# EAGLE schematic harp camera controller (EAGLE 9.5.1)
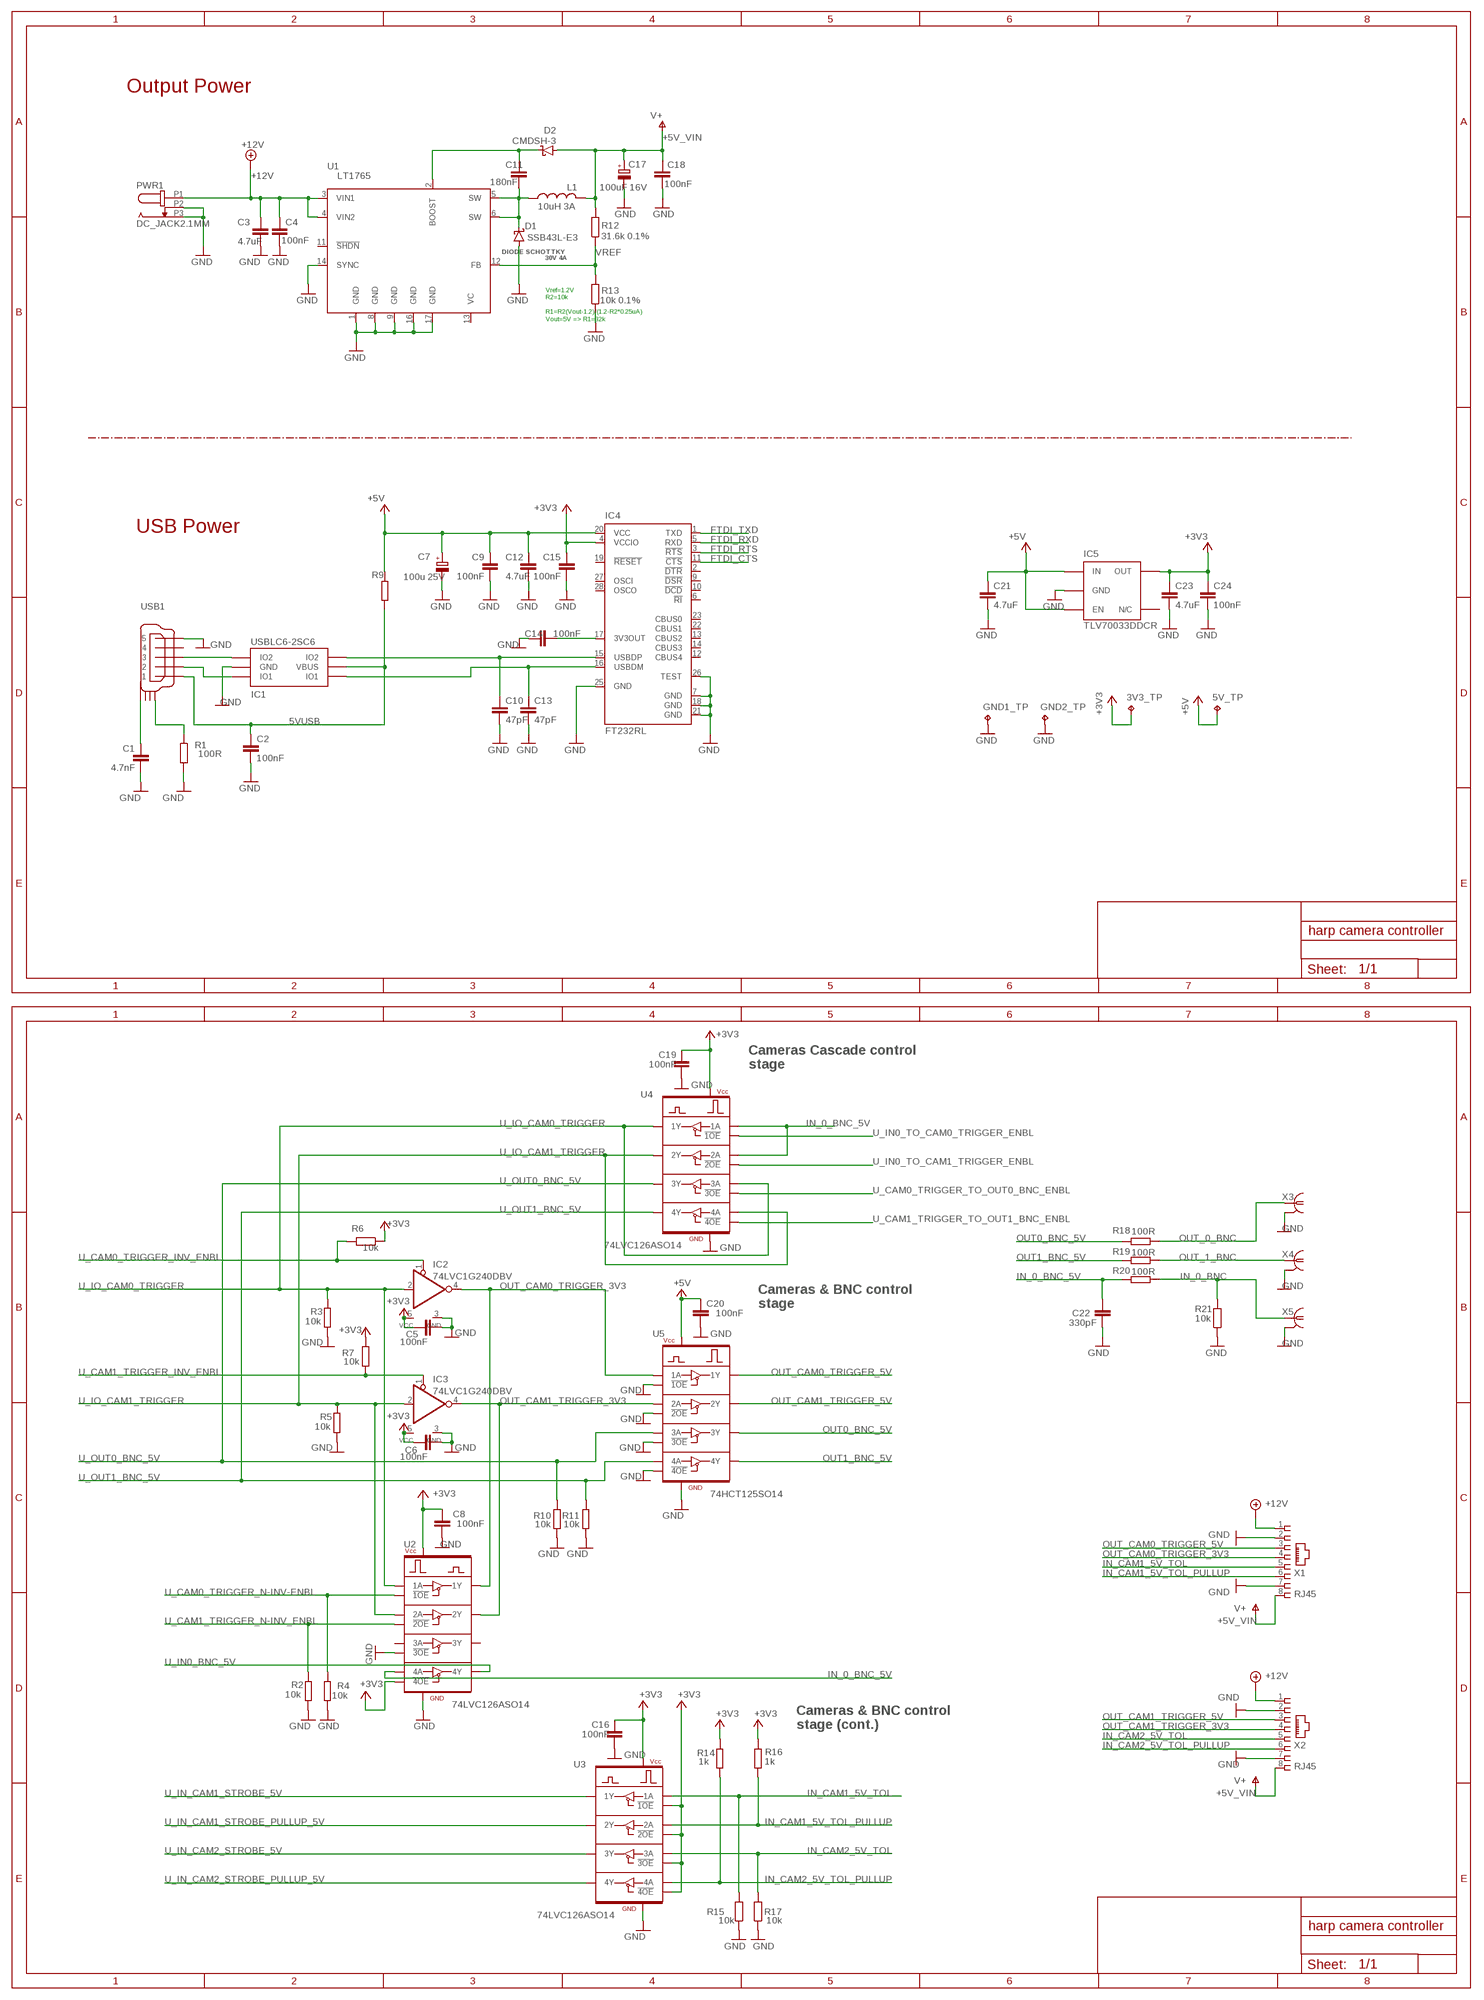
[diagram p0: schematic, sheet 1, part 1 of 2]
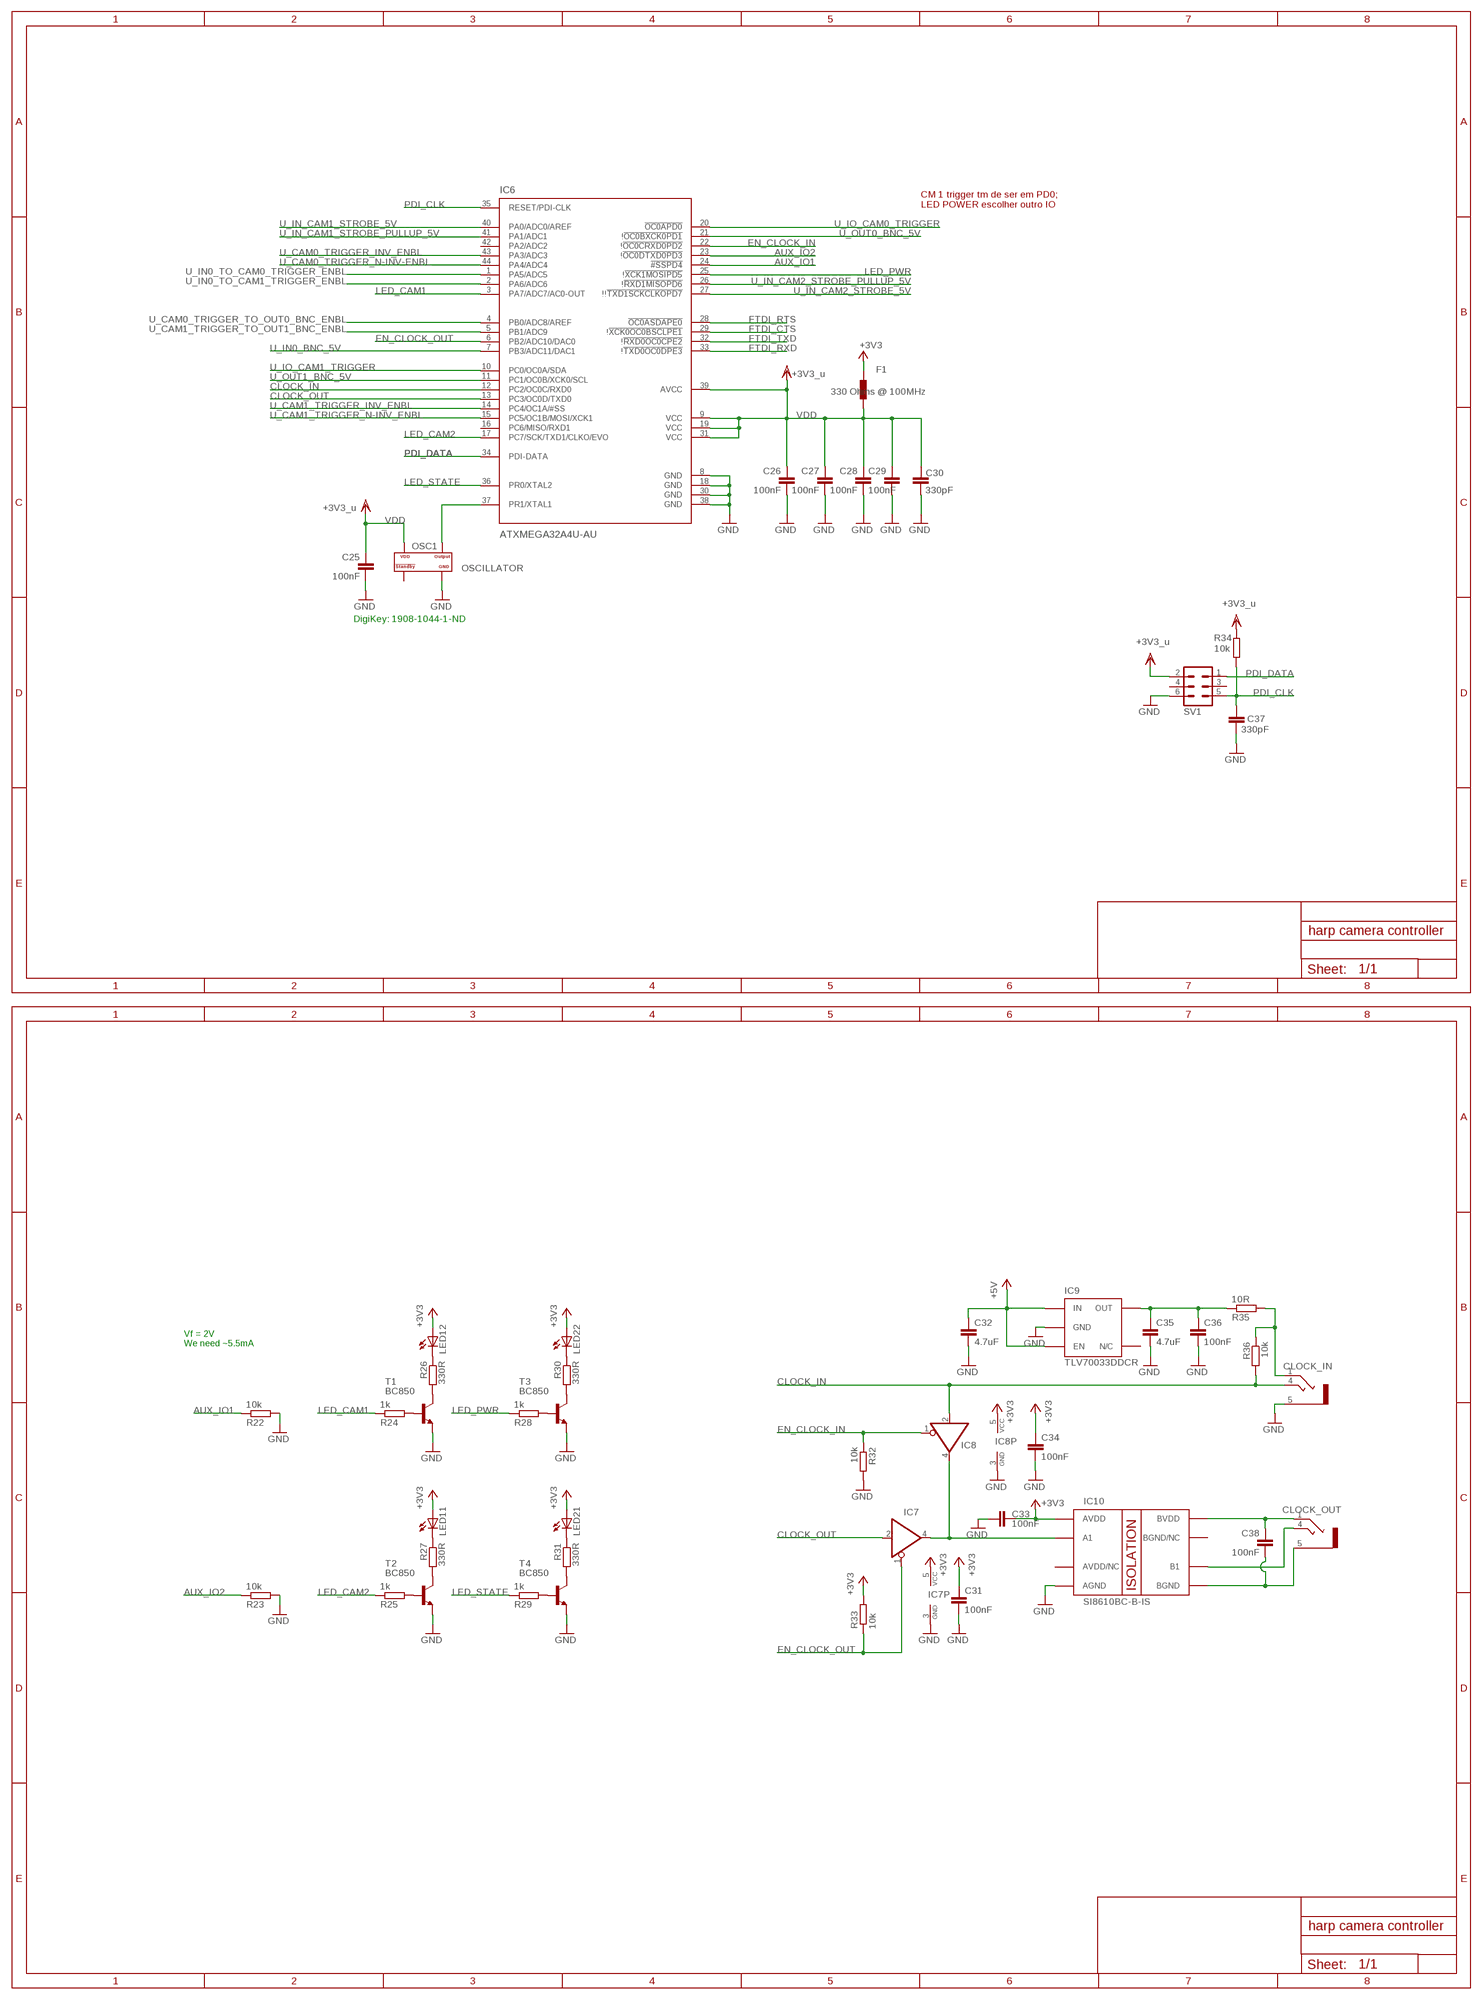
[diagram p1: schematic, sheet 1, part 2 of 2]

## Parts
3V3_TP  TPPAD1-13  [P1-13]
5V_TP  TPPAD1-13  [P1-13]
C1  4.7nF  C-EUC0402  [C0402]
C2  100nF  C-EUC0402  [C0402]
C3  4.7uF  C-EUC0805  [C0805]
C4  100nF  C-EUC0402  [C0402]
C5  100nF  C-EUC0402  [C0402]
C6  100nF  C-EUC0402  [C0402]
C7  100u 25V  CPOL-EUTT2D6  [TT2D6]
C8  100nF  C-EUC0402  [C0402]
C9  100nF  C-EUC0402  [C0402]
C10  47pF  C-EUC0402  [C0402]
C11  180nF  C-EUC0603  [C0603]
C12  4.7uF  C-EUC0603  [C0603]
C13  47pF  C-EUC0402  [C0402]
C14  100nF  C-EUC0402  [C0402]
C15  100nF  C-EUC0402  [C0402]
C16  100nF  C-EUC0402  [C0402]
C17  100uF 16V  CPOL-EUCT7343  [CT7343]
C18  100nF  C-EUC0402  [C0402]
C19  100nF  C-EUC0402  [C0402]
C20  100nF  C-EUC0402  [C0402]
C21  4.7uF  C-EUC0603  [C0603]
C22  330pF  C-EUC0402  [C0402]
C23  4.7uF  C-EUC0603  [C0603]
C24  100nF  C-EUC0402  [C0402]
C25  100nF  C-EUC0402  [C0402]
C26  100nF  C-EUC0402  [C0402]
C27  100nF  C-EUC0402  [C0402]
C28  100nF  C-EUC0402  [C0402]
C29  100nF  C-EUC0402  [C0402]
C30  330pF  C-EUC0402  [C0402]
C31  100nF  C-EUC0402  [C0402]
C32  4.7uF  C-EUC0603  [C0603]
C33  100nF  C-EUC0402  [C0402]
C34  100nF  C-EUC0402  [C0402]
C35  4.7uF  C-EUC0603  [C0603]
C36  100nF  C-EUC0402  [C0402]
C37  330pF  C-EUC0402  [C0402]
C38  100nF  C-EUC0402  [C0402]
CLOCK_IN  CLCK_JACK  STEREO_JACK  [35RASMT2BHNTRX]
CLOCK_OUT  CLCK_JACK  STEREO_JACK  [35RASMT2BHNTRX]
D1  SSB43L-E3  SCHOTTKY-DIODE  [SMB]
D2  CMDSH-3  SCHOTTKY-DIODESOD323  [SOD323-R]
F1  330 Ohms @ 100MHz  BLM15HF0603  [R0603]
GND1_TP  TPPAD1-13  [P1-13]
GND2_TP  TPPAD1-13  [P1-13]
IC1  USBLC6-2SC6  USBLC6-2  [SOT23-6L]
IC2  74LVC1G240DBV  [SOT23-5]
IC3  74LVC1G240DBV  [SOT23-5]
IC4  FT232RL  [SSOP28]
IC5  TLV70033DDCR  TLV700XX  [TSOT23-5]
IC6  ATXMEGA32A4U-AU  AT-XMEGA-XXA4-AU  [QFP80P1200X1200X120-44N]
IC7  SN74LVC1G125DBVT  74AHC1G125DBV  [SOT23-5]
IC8  SN74LVC1G125DBVT  74AHC1G125DBV  [SOT23-5]
IC9  TLV70033DDCR  TLV700XX  [TSOT23-5]
IC10  SI8610BC-B-IS  SI8610  [SO-08]
L1  10uH 3A  L_IHLP2525CZER100M01  [L_IHLP_PADS]
LED1  RED_LEDs  LED_2X_VERTICAL  [569-011X-X00_LED_ARRAY]
LED2  RED_LEDs  LED_2X_VERTICAL  [569-011X-X00_LED_ARRAY]
OSC1  OSCILLATOR  [OSCILLATOR_3.2X2.5]
PWR1  DC_JACK2.1MM  [DC_POWER_INPUT_2.1MM]
R1  100R  R-EU_R0603  [R0603]
R2  10k  R-EU_R0402  [R0402]
R3  10k  R-EU_R0402  [R0402]
R4  10k  R-EU_R0402  [R0402]
R5  10k  R-EU_R0402  [R0402]
R6  10k  R-EU_R0402  [R0402]
R7  10k  R-EU_R0402  [R0402]
R9  40R@100MHz  R-EU_R0805  [R0805]
R10  10k  R-EU_R0402  [R0402]
R11  10k  R-EU_R0402  [R0402]
R12  31.6k 0.1%  R-EU_R0402  [R0402]
R13  10k 0.1%  R-EU_R0402  [R0402]
R14  1k  R-EU_R0402  [R0402]
R15  10k  R-EU_R0402  [R0402]
R16  1k  R-EU_R0402  [R0402]
R17  10k  R-EU_R0402  [R0402]
R18  100R  R-EU_R0603  [R0603]
R19  100R  R-EU_R0603  [R0603]
R20  100R  R-EU_R0603  [R0603]
R21  10k  R-EU_R0402  [R0402]
R22  10k  R-EU_R0402  [R0402]
R23  10k  R-EU_R0402  [R0402]
R24  1k  R-EU_R0402  [R0402]
R25  1k  R-EU_R0402  [R0402]
R26  330R  R-EU_R0402  [R0402]
R27  330R  R-EU_R0402  [R0402]
R28  1k  R-EU_R0402  [R0402]
R29  1k  R-EU_R0402  [R0402]
R30  330R  R-EU_R0402  [R0402]
R31  330R  R-EU_R0402  [R0402]
R32  10k  R-EU_R0402  [R0402]
R33  10k  R-EU_R0402  [R0402]
R34  10k  R-EU_R0402  [R0402]
R35  10R  R-EU_R0402  [R0402]
R36  10k  R-EU_R0402  [R0402]
SV1  PROG HEADER  MA03-2  [MA03-2]
T1  BC850  [SOT23]
T2  BC850  [SOT23]
T3  BC850  [SOT23]
T4  BC850  [SOT23]
U1  LT1765  [TSSOP16EXP]
U2  74LVC126ASO14  [SO14]
U3  74LVC126ASO14  [SO14]
U4  74LVC126ASO14  [SO14]
U5  74HCT125SO14  [SO14]
USB1  mini USB  USB_MINI_B  [240-0002-1]
X1  RJ45  [RJ45-NO-SHIELD]
X2  RJ45  [RJ45-NO-SHIELD]
X3  BNC plug  BNC_0731000105  [0731000105]
X4  BNC plug  BNC_0731000105  [0731000105]
X5  BNC plug  BNC_0731000105  [0731000105]

## Nets
5VUSB: C2.1 IC1.P$5(VBUS) R9.2 USB1.P$1
+3V3: 3V3_TP.TP C5.1 C6.1 C8.1 C15.1 C16.1 C19.1 C23.1 C24.1 C31.1 C33.1 C34.1 F1.2 IC2.5(VCC) IC3.5(VCC) IC4.4(VCCIO) IC5.5(OUT) IC7.5(VCC) IC8.5(VCC) IC10.1(AVDD) LED1.A1(1:A) LED1.A2(2:A) LED2.A1(1:A) LED2.A2(2:A) R6.1 R7.1 R14.1 R16.1 R33.2 U2.13(!4OE) U2.14(VCC) U3.1(!1OE) U3.4(!2OE) U3.10(!3OE) U3.13(!4OE) U3.14(VCC) U4.14(VCC)
+5V: 5V_TP.TP C7.+ C9.1 C12.1 C20.1 C21.1 C32.1 IC4.20(VCC) IC5.1(IN) IC5.3(EN) IC9.1(IN) IC9.3(EN) R9.1 U5.14(VCC)
+5V_VIN: C17.+ C18.1 D2.A L1.1 R12.2 X1.8 X2.8 ; supply symbol labelled V+
+12V: C3.1 C4.1 PWR1.P1 U1.3(VIN1) U1.4(VIN2) X1.1 X2.1
AUX_IO1: IC6.24(!#SSPD4) R22.1
AUX_IO2: IC6.23(!!OC0DTXD0PD3) R23.1
CLOCK_IN: CLOCK_IN.4 IC6.12(PC2/OC0C/RXD0) IC8.2(I) R36.2
CLOCK_OUT: IC6.13(PC3/OC0D/TXD0) IC7.2(I)
EN_CLOCK_IN: IC6.22(!!OC0CRXD0PD2) IC8.1(OE) R32.1
EN_CLOCK_OUT: IC6.6(PB2/ADC10/DAC0) IC7.1(OE) R33.1
FTDI_CTS: IC4.11(!CTS) IC6.29(!!XCK0OC0BSCLPE1)
FTDI_RTS: IC4.3(!RTS) IC6.28(!OC0ASDAPE0)
FTDI_RXD: IC4.5(RXD) IC6.33(!!TXD0OC0DPE3)
FTDI_TXD: IC4.1(TXD) IC6.32(!!RXD0OC0CPE2)
GND: C1.2 C2.2 C3.2 C4.2 C5.2 C6.2 C7.- C8.2 C9.2 C10.2 C12.2 C13.2 C14.2 C15.2 C16.2 C17.- C18.2 C19.2 C20.2 C21.2 C22.2 C23.2 C24.2 C25.2 C26.2 C27.2 C28.2 C29.2 C30.2 C31.2 C32.2 C33.2 C34.2 C35.2 C36.2 C37.2 CLOCK_IN.5 D1.A GND1_TP.TP GND2_TP.TP IC1.P$2(GND) IC2.3(GND) IC3.3(GND) IC4.7(GND) IC4.18(GND) IC4.21(GND) IC4.25(GND) IC4.26(TEST) IC5.2(GND) IC6.8(GND) IC6.18(GND) IC6.30(GND) IC6.38(GND) IC7.3(GND) IC8.3(GND) IC9.2(GND) IC10.4(AGND) OSC1.P$2(GND) PWR1.P2 PWR1.P3 R1.2 R2.1 R3.1 R4.1 R5.1 R10.2 R11.2 R13.1 R15.1 R17.1 R21.1 R22.2 R23.2 R32.2 SV1.6 T1.2(E) T2.2(E) T3.2(E) T4.2(E) U1.1(GND) U1.8(GND) U1.9(GND) U1.14(SYNC) U1.16(GND) U1.17(GND) U2.7(GND) U2.10(!3OE) U3.7(GND) U4.7(GND) U5.1(!1OE) U5.4(!2OE) U5.7(GND) U5.10(!3OE) U5.13(!4OE) USB1.P$5 X1.2 X1.7 X2.2 X2.7 X3.2 X3.3 X4.2 X4.3 X5.2 X5.3
GND_ISO: C38.2 CLOCK_OUT.5 IC10.5(BGND)
IN_0_BNC [IOss]: R20.1 R21.2 X5.1
IN_0_BNC_5V [IOss]: C22.1 R20.2 U2.12(4A) U4.2(1A) U4.5(2A)
IN_CAM1_5V_TOL: R15.2 U3.2(1A) X1.5
IN_CAM1_5V_TOL_PULLUP: R16.2 U3.5(2A) X1.6
IN_CAM2_5V_TOL: R17.2 U3.9(3A) X2.5
IN_CAM2_5V_TOL_PULLUP: R14.2 U3.12(4A) X2.6
LED_CAM1: IC6.3(PA7/ADC7/AC0-OUT) R24.1
LED_CAM2: IC6.17(PC7/SCK/TXD1/CLKO/EVO) R25.1
LED_PWR: IC6.25(!!XCK1MOSIPD5) R28.1
LED_STATE: IC6.36(PR0/XTAL2) R29.1
N$1: R24.2 T1.1(B)
N$2: CLOCK_OUT.4 IC10.6(B1)
N$5: C38.1 CLOCK_OUT.1 IC10.8(BVDD)
N$7: R26.2 T1.3(C)
N$17: C11.2 D1.C L1.2 U1.5(SW) U1.6(SW)
N$19: C11.1 D2.C U1.2(BOOST)
N$34: R25.2 T2.1(B)
N$38: C14.1 IC4.17(3V3OUT)
N$40: IC1.P$1(IO1) USB1.P$2
N$41: CLOCK_IN.1 R35.2 R36.1
N$42: C35.1 C36.1 IC9.5(OUT) R35.1
N$43: IC7.4(O) IC8.4(O) IC10.2(A1)
N$47: R27.2 T2.3(C)
N$50: IC1.P$3(IO2) USB1.P$3
N$53: R28.2 T3.1(B)
N$54: R30.2 T3.3(C)
N$56: R29.2 T4.1(B)
N$59: C1.1 USB1.SHIELD_4
N$60: R31.2 T4.3(C)
N$61: R1.1 USB1.SHIELD_1
N$62: LED2.C1(1:C) R31.1
N$63: LED2.C2(2:C) R30.1
N$65: LED1.C2(2:C) R26.1
N$66: LED1.C1(1:C) R27.1
OSC2: IC6.37(PR1/XTAL1) OSC1.P$3(OUTPUT)
OUT0_BNC_5V: R18.2 U5.8(3Y)
OUT1_BNC_5V: R19.2 U5.11(4Y)
OUT_0_BNC [IOss]: R18.1 X3.1
OUT_1_BNC [IOss]: R19.1 X4.1
OUT_CAM0_TRIGGER_3V3: IC2.4(O) U2.3(1Y) U5.2(1A) X1.4
OUT_CAM0_TRIGGER_5V: U5.3(1Y) X1.3
OUT_CAM1_TRIGGER_3V3: IC3.4(O) U2.6(2Y) U5.5(2A) X2.4
OUT_CAM1_TRIGGER_5V: U5.6(2Y) X2.3
PDI_CLK: C37.1 IC6.35(RESET/PDI-CLK) R34.1 SV1.5
PDI_DATA: IC6.34(PDI-DATA) SV1.1
U_CAM0_TRIGGER_INV_ENBL: IC2.1(OE) IC6.43(PA3/ADC3) R6.2
U_CAM0_TRIGGER_N-INV-ENBL: IC6.44(PA4/ADC4) R4.2 U2.1(!1OE)
U_CAM0_TRIGGER_TO_OUT0_BNC_ENBL: IC6.4(PB0/ADC8/AREF) U4.10(!3OE)
U_CAM1_TRIGGER_INV_ENBL: IC3.1(OE) IC6.14(PC4/OC1A/#SS) R7.2
U_CAM1_TRIGGER_N-INV_ENBL: IC6.15(PC5/OC1B/MOSI/XCK1) R2.2 U2.4(!2OE)
U_CAM1_TRIGGER_TO_OUT1_BNC_ENBL: IC6.5(PB1/ADC9) U4.13(!4OE)
U_IN0_BNC_5V: IC6.7(PB3/ADC11/DAC1) U2.11(4Y)
U_IN0_TO_CAM0_TRIGGER_ENBL: IC6.1(PA5/ADC5) U4.1(!1OE)
U_IN0_TO_CAM1_TRIGGER_ENBL: IC6.2(PA6/ADC6) U4.4(!2OE)
U_IN_CAM1_STROBE_5V: IC6.40(PA0/ADC0/AREF) U3.3(1Y)
U_IN_CAM1_STROBE_PULLUP_5V: IC6.41(PA1/ADC1) U3.6(2Y)
U_IN_CAM2_STROBE_5V: IC6.27(!!!TXD1SCKCLKOPD7) U3.8(3Y)
U_IN_CAM2_STROBE_PULLUP_5V: IC6.26(!!RXD1MISOPD6) U3.11(4Y)
U_IO_CAM0_TRIGGER: IC2.2(I) IC6.20(!OC0APD0) R3.2 U2.2(1A) U4.3(1Y) U4.9(3A)
U_IO_CAM1_TRIGGER: IC3.2(I) IC6.10(PC0/OC0A/SDA) R5.2 U2.5(2A) U4.6(2Y) U4.12(4A)
U_OUT0_BNC_5V: IC6.21(!!OC0BXCK0PD1) R10.1 U4.8(3Y) U5.9(3A)
U_OUT1_BNC_5V: IC6.11(PC1/OC0B/XCK0/SCL) R11.1 U4.11(4Y) U5.12(4A)
USBDM: C13.1 IC1.P$6(IO1) IC4.16(USBDM)
USBDP: C10.1 IC1.P$4(IO2) IC4.15(USBDP)
VDD: C25.1 C26.1 C27.1 C28.1 C29.1 C30.1 F1.1 IC6.9(VCC) IC6.19(VCC) IC6.31(VCC) IC6.39(AVCC) OSC1.P$4(VDD) R34.2 SV1.2 ; supply symbol labelled +3V3_u
VREF: R12.1 R13.2 U1.12(FB)
Unconnected: IC4.2(!DTR) IC4.6(!RI) IC4.9(!DSR) IC4.10(!DCD) IC4.12(CBUS4) IC4.13(CBUS2) IC4.14(CBUS3) IC4.19(!RESET) IC4.22(CBUS1) IC4.23(CBUS0) IC4.27(OSCI) IC4.28(OSCO) IC5.4(N/C) IC6.16(PC6/MISO/RXD1) IC6.42(PA2/ADC2) IC9.4(N/C) IC10.3(AVDD/NC) IC10.7(BGND/NC) OSC1.P$1(STANDBY#) SV1.3 SV1.4 U1.7(NC7) U1.10(NC10) U1.11(!SHDN) U1.13(VC) U1.15(NC15) U2.8(3Y) U2.9(3A) USB1.P$4 USB1.SHIELD_2 USB1.SHIELD_3

## Notes on the sheet
- Output Power
- CM 1 trigger tm de ser em PD0; 
  LED POWER escolher outro IO
- DIODE SCHOTTKY 
  30V 4A
- Vref=1.2V
  R2=10k
  
  R1=R2(Vout-1.2)/(1.2-R2*0.25uA)
  Vout=5V => R1=32k
- USB Power
- DigiKey: 1908-1044-1-ND
- Cameras Cascade control
  stage
- Cameras & BNC control
  stage
- Vf = 2V
  We need ~5.5mA
- Cameras & BNC control
  stage (cont.)

## Library data of the parts
3V3_TP 5V_TP GND1_TP GND2_TP = harp camera controller:TP: Test pad; DIGIKEY_PN: N.A.; MOUSER_PN: N.A.; MPN: N.A.; NOTES: PCB TEST PAD; TYPE: N.A.
C1 = rcl:C-EU: CAPACITOR, European symbol; DIGIKEY_PN: 732-12234-1-ND; MPN: 885012205084; NOTES: -; TYPE: SMD
C2 C4-C6 C8 C9 C14-C16 C18-C20 C24-C29 C31 C33 C34 C36 C38 = rcl:C-EU: CAPACITOR, European symbol; DIGIKEY_PN: 445-5932-1-ND; MPN: C1005X7R1H104K050BB; NOTES: -; TYPE: SMD
C3 = rcl:C-EU: CAPACITOR, European symbol; DIGIKEY_PN: 1276-6722-1-ND; MPN: CL21A475KLCLQNC; TYPE: SMD
C7 = rcl:CPOL-EU: POLARIZED CAPACITOR, European symbol; DIGIKEY_PN: P19702CT-ND; MPN: EEU-FM1E101B; NOTES: -; TYPE: SMD
C10 C13 = rcl:C-EU: CAPACITOR, European symbol; DIGIKEY_PN: 478-1078-1-ND; MPN: 04025A470JAT2A; NOTES: -; TYPE: SMD
C11 = rcl:C-EU: CAPACITOR, European symbol; DIGIKEY_PN: 490-GCG188R91H184KA01DCT-ND; MPN: GCG188R91H184KA01D; TYPE: SMD
C12 C21 C23 C32 C35 = rcl:C-EU: CAPACITOR, European symbol; DIGIKEY_PN: 445-9118-1-ND; MPN: C1608X6S1C475K080AC; NOTES: -; TYPE: SMD
C17 = rcl:CPOL-EU: POLARIZED CAPACITOR, European symbol; DIGIKEY_PN: 399-18066-1-ND; MPN: T491D107K016AT7280; TYPE: SMD
C22 C30 C37 = rcl:C-EU: CAPACITOR, European symbol; DIGIKEY_PN: 399-7787-1-ND; MPN: C0402C331J5GACTU; NOTES: -; TYPE: SMD
CLOCK_IN CLOCK_OUT = harp camera controller:STEREO_JACK: CONN JACK STEREO 3.5MM SMD R/A; DIGIKEY_PN: SC1489-1-ND; MOUSER_PN: 502-35RASMT2BHNTRX; MPN: 35RASMT2BHNTRX; NOTES: -; TYPE: SMD
D1 = harp camera controller:SCHOTTKY-DIODE: Schottky Diode; DIGIKEY_PN: SSB43L-E3/52TGICT-ND; MOUSER_PN: 625-SSB43L-E3; MPN: SSB43L-E3/52T; NOTES: -; TYPE: SMD
D2 = harp camera controller:SCHOTTKY-DIODE: Schottky Diode; DIGIKEY_PN: 1514-CMDSH-3TRPBFREECT-ND; MOUSER_PN: 610-CMDSH-3; MPN: CMDSH-3; NOTES: -; TYPE: SMD
F1 = harp camera controller:BLM15H: EMIFIL (R) Chip Ferrite Bead for GHz Noise Source: http://www.murata.com/ Ferrite Bead BLM15H.pdf; DIGIKEY_PN: 490-3997-1-ND; MOUSER_PN: 81-BLM18SG331TN1D; MPN: BLM18SG331TN1D; NOTES: -; TYPE: SMD
IC1 = harp camera controller:USBLC6-2: TVS DIODE 5.25V 17V; DIGIKEY_PN: 497-5235-1-ND; MOUSER_PN: 511-USBLC6-2SC6; MPN: USBLC6-2SC6; NOTES: EQUIVALENT: RCLAMP0504S.TCT; TYPE: SMD
IC2 IC3 = harp camera controller:74LVC1G240: Single Bus Buffer Gate with 3-State Output; DIGIKEY_PN: 296-11609-1-ND; MOUSER_PN: 595-SN74LVC1G240DBVR; MPN: SN74LVC1G240DBVR; NOTES: -; TYPE: SMD
IC4 = harp camera controller:FT232R: UART/FIFO IC; DIGIKEY_PN: 768-1007-1-ND; MOUSER_PN: 895-FT232RL; MPN: FT232RL-REEL; NOTES: -; TYPE: SMD
IC5 IC9 = harp camera controller:TLV700XX: IC REG LINEAR 3.3V 200MA SOT23-5; DIGIKEY_PN: 296-27937-1-ND; MOUSER_PN: 595-TLV70033DDCR; MPN: TLV70033DDCR; NOTES: SIMILAR & AVAILABLE = LP5951MFX-3.3/NOPB >> DIGIKEY_PN: 296-47807-2-ND MOUSER_PN: 926-LP5951MFX33NOPB; TYPE: SMD
IC6 = harp camera controller:AT-XMEGA-XXA4-AU: ATxMega a4 Serie; DIGIKEY_PN: ATXMEGA32A4U-AURCT-ND; MOUSER_PN: 556-ATXMEGA32A4U-AU; MPN: ATXMEGA32A4U-AUR; NOTES: -; TYPE: SMD
IC7 IC8 = 74xx-little-de:74*1G125: Single Bus Buffer Gate with 3-State Output; DIGIKEY_PN: 296-26595-1-ND; MOUSER_PN: 595-SN74LVC1G125DBVT; MPN: SN74LVC1G125DBVT; NOTES: -; TYPE: SMD
IC10 = harp camera controller:SI8610: DGTL ISO 3750VRMS 1CH GP 8SOIC; DIGIKEY_PN: 336-2058-5-ND; MOUSER_PN: 634-SI8610EC-B-IS; MPN: SI8610EC-B-IS; NOTES: ALTERNATIVE: ADUM110N0BRZ; TYPE: SMD
L1 = harp camera controller:L_IHLP2525CZER100M01: FIXED IND 10UH 3A 105 MOHM SMD; DIGIKEY_PN: 541-1013-2-ND; MOUSER_PN: 70-IHLP2525CZER100M0; MPN: IHLP2525CZER100M01; TYPE: SMD
LED1 LED2 = harp camera controller:LED_2X: LED 2HI 3MM NARROW RED PC MNT; DIGIKEY_PN: 350-1782-ND; MOUSER_PN: 645-569-0111-100F; MPN: 5690-111-100F; NOTES: -; TYPE: TH
OSC1 = harp camera controller:OSCILLATOR: XTAL OSC TCXO 32.0000MHZ HCMOS; 4-SMD; DIGIKEY_PN: 1908-1044-1-ND; MOUSER_PN: N.A. - ALTERNATIVE ONLY; MPN: O 32,0-JT32C-A-K-3,3-LF; NOTES: ALTERNATIVE: DSC1001CI5-032.0000; TYPE: SMD
PWR1 = harp camera controller:DC_JACK: DC Power Connectors PCB 2.1MM; DIGIKEY_PN: DIGIKEY N.A.; MOUSER_PN: 163-179PH; MPN: 163-179PH-EX; NOTES: -; TYPE: TH
R1 R18-R20 = rcl:R-EU_: RESISTOR, European symbol; DIGIKEY_PN: P100HCT-ND; MPN: ERJ-3EKF1000V; NOTES: -; TYPE: SMD
R2-R7 R10 R11 R13 R15 R17 R21-R23 R32-R34 R36 = rcl:R-EU_: RESISTOR, European symbol; DIGIKEY_PN: 541-3959-1-ND; MPN: CRCW040210K0FKED; NOTES: -; TYPE: SMD
R9 = rcl:R-EU_: RESISTOR, European symbol; DIGIKEY_PN: 240-2389-1-ND; MPN: MI0805K400R-10; NOTES: -; TYPE: SMD
R12 = rcl:R-EU_: RESISTOR, European symbol; DIGIKEY_PN: 311-40.2KLRCT-ND; MPN: RC0402FR-0740K2L; TYPE: SMD
R14 R16 R24 R25 R28 R29 = rcl:R-EU_: RESISTOR, European symbol; DIGIKEY_PN: 541-3961-1-ND; MPN: CRCW04021K00FKEDC; NOTES: -; TYPE: SMD
R26 R27 R30 R31 = rcl:R-EU_: RESISTOR, European symbol; DIGIKEY_PN: 311-330LRCT-ND; MPN: RC0402FR-07330RL; NOTES: -; TYPE: SMD
R35 = rcl:R-EU_: RESISTOR, European symbol; DIGIKEY_PN: 541-3964-2-ND; MPN: CRCW040210R0FKEDC; NOTES: -; TYPE: SMD
SV1 = harp camera controller:MA03-2: PIN HEADER; DIGIKEY_PN: 732-5295-ND; MOUSER_PN: 710-61300621121; MPN: 61300621121; NOTES: -; TYPE: TH
T1-T4 = transistor:BC850: NPN TRANSISTOR; DIGIKEY_PN: 1727-4862-1-ND; MOUSER_PN: 771-BC850C-T/R; MPN: BC850C,215; NOTES: -; TYPE: SMD
U1 = harp camera controller:LT1765: Monolithic 3A, 1.25MHz Step-Down Switching Regulator; DIGIKEY_PN: LT1765EFE#PBF-ND; MOUSER_PN: 584-LT1765EFE#TRPBF; MPN: LT1765EFE#PBF; NOTES: -; TYPE: SMD
U2-U4 = harp camera controller:74LVC126A: Quad buffer/line driver; 3-state; DIGIKEY_PN: 1727-6365-1-ND; MOUSER_PN: 771-LVC126AD118; MPN: 74LVC126AD,118; NOTES: -; TYPE: SMD
U5 = harp camera controller:74HCT125: Quad buffer/line driver; 3-state; DIGIKEY_PN: 1727-2834-1-ND; MOUSER_PN: 771-74HCT125D-T; MPN: 74HCT125D,653; NOTES: -; TYPE: SMD
USB1 = harp camera controller:USB_MINI_B: CONN RCPT USB2.0 MINI B SMD R/A; DIGIKEY_PN: H2960TR-ND; MOUSER_PN: 798-UX60-MB-5S8; MPN: UX60-MB-5S8; NOTES: END OF LIFE COMPONENT BY SEPTEMBER 2021; TYPE: SMD
X1 X2 = harp camera controller:RJ45: RJ45 8pin; DIGIKEY_PN: A105009CT-ND; MOUSER_PN: 571-2158771; MPN: 215877-1; NOTES: -; TYPE: TH
X3-X5 = harp camera controller:BNC: BNC CONNECTOR M/A COM www.macom.com distributor Farnell 149-452; DIGIKEY_PN: WM5524-ND; MOUSER_PN: N.A.; MPN: 73100-0105; NOTES: -; TYPE: TH

## Net classes
0 default: clearance 0.205 mm
1 IOss: clearance 0.35 mm